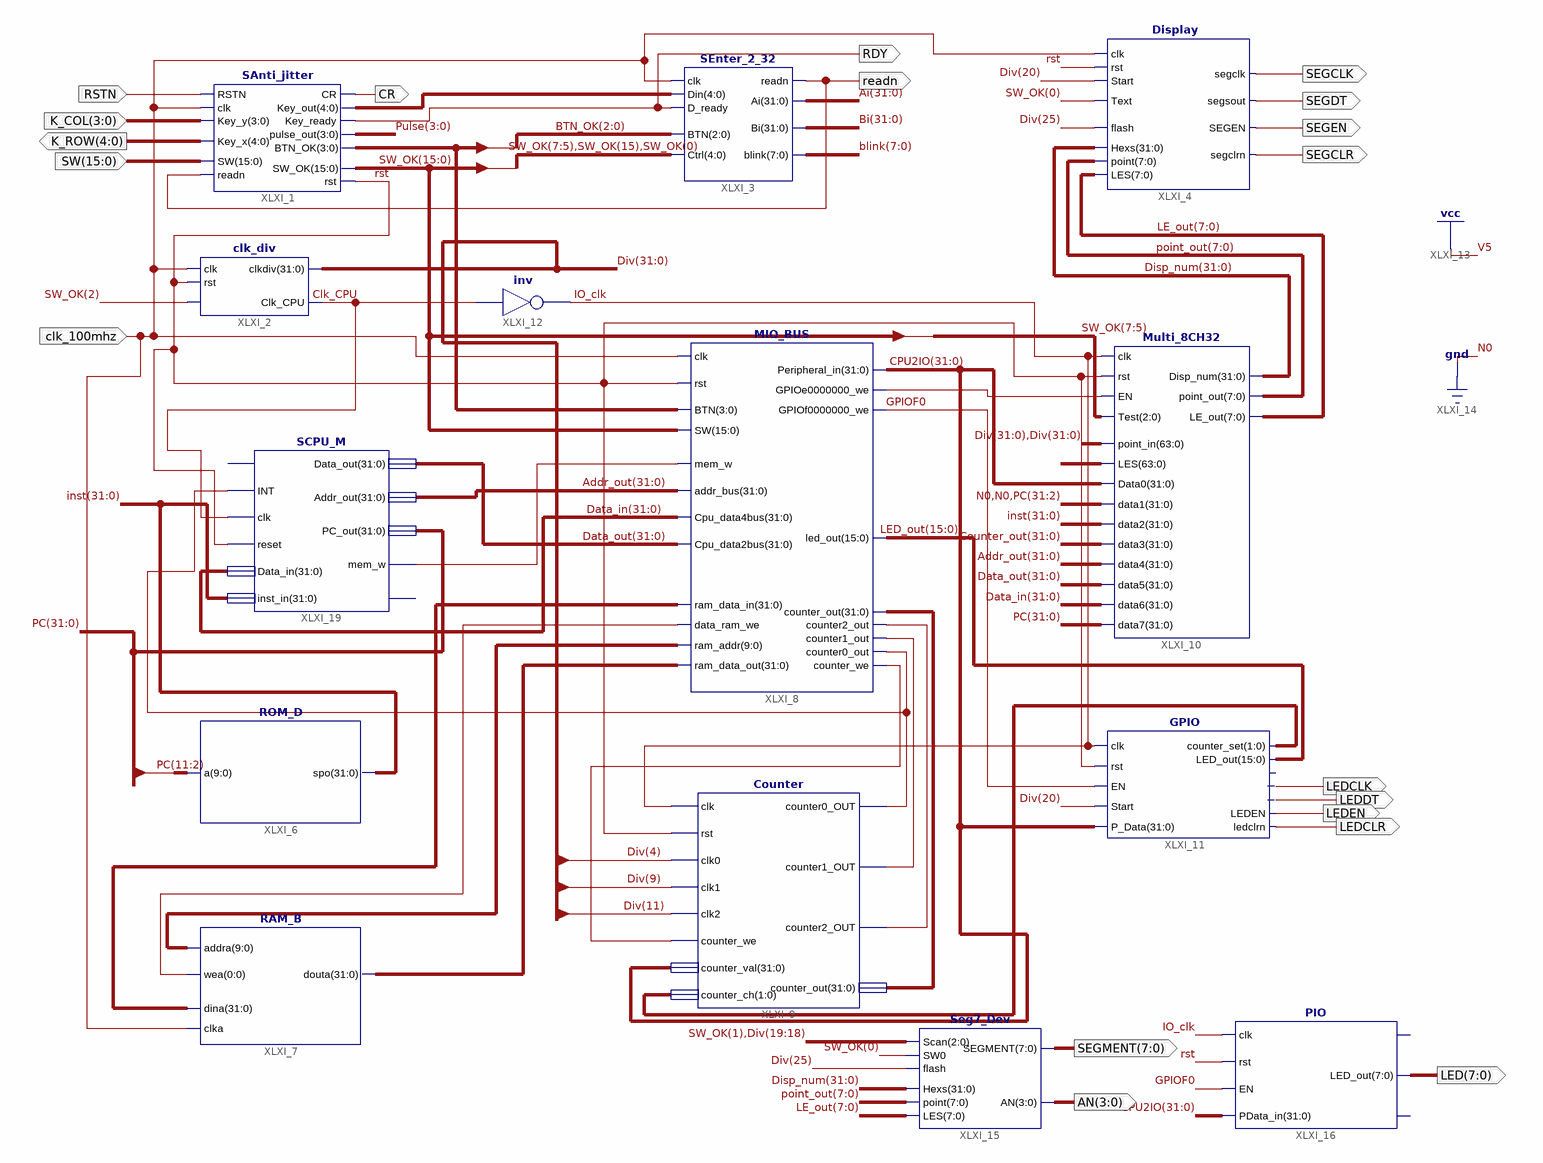
[diagram p0: schematic sheet 1]
// Xilinx ISE schematic OExp07_ExtSCPU_3180101226.sch (kintex7) as structural Verilog: 14 symbols, 19 ports
module OExp07_ExtSCPU_3180101226 (
  input  RSTN,
  input  [3:0] K_COL,
  input  [15:0] SW,
  input  clk_100mhz,
  output [4:0] K_ROW,
  output readn,
  output CR,
  output RDY,
  output SEGCLK,
  output SEGDT,
  output SEGEN,
  output SEGCLR,
  output LEDCLK,
  output LEDDT,
  output LEDEN,
  output LEDCLR,
  output [7:0] SEGMENT,
  output [3:0] AN,
  output [7:0] LED
);

  wire Clk_CPU, GPIOF0, IO_clk, rst, XLXN_73, XLXN_92, XLXN_93, XLXN_94, XLXN_96, XLXN_100;
  wire [0:0] XLXN_62;
  wire [1:0] XLXN_98;
  wire [3:0] BTN_OK, Pulse;
  wire [4:0] XLXN_9;
  wire [7:0] blink, LE_out, point_out;
  wire [9:0] XLXN_63;
  wire [15:0] LED_out, SW_OK;
  wire [31:0] Addr_out, Ai, Bi, Counter_out, CPU2IO, Data_in, Data_out, Disp_num, Div, inst, PC, XLXN_59,
       XLXN_65, XLXN_91;

  SAnti_jitter XLXI_1 (
    .SW(SW), .readn(readn), .Key_y(K_COL), .Key_x(K_ROW), .RSTN(RSTN), .clk(clk_100mhz), .Key_out(XLXN_9),
    .Key_ready(RDY), .CR(CR), .rst(rst), .SW_OK(SW_OK), .pulse_out(Pulse), .BTN_OK(BTN_OK));
  clk_div XLXI_2 (.rst(rst), .clk(clk_100mhz), .clkdiv(Div), .Clk_CPU(Clk_CPU));  // open: SW2
  SEnter_2_32 XLXI_3 (
    .readn(readn), .Ai(Ai), .Bi(Bi), .blink(blink), .Din(XLXN_9), .D_ready(RDY), .clk(clk_100mhz),
    .Ctrl({SW_OK[7:5], SW_OK[15], SW_OK[0]}), .BTN(BTN_OK[2:0]));
  Display XLXI_4 (
    .LES(LE_out), .SEGEN(SEGEN), .segsout(SEGDT), .segclrn(SEGCLR), .point(point_out), .Hexs(Disp_num),
    .Text(SW_OK[0]), .flash(Div[25]), .segclk(SEGCLK), .clk(clk_100mhz), .rst(rst), .Start(Div[20]));
  ROM_D XLXI_6 (.a(PC[11:2]), .spo(inst));
  RAM_B XLXI_7 (.addra(XLXN_63), .clka(clk_100mhz), .wea(XLXN_62[0]), .dina(XLXN_59), .douta(XLXN_65));
  MIO_BUS XLXI_8 (
    .rst(rst), .clk(clk_100mhz), .mem_w(XLXN_100), .addr_bus(Addr_out), .Cpu_data4bus(Data_in),
    .Cpu_data2bus(Data_out), .ram_data_out(XLXN_65), .ram_addr(XLXN_63), .data_ram_we(XLXN_62[0]),
    .ram_data_in(XLXN_59), .counter_out(XLXN_91), .counter2_out(XLXN_92), .counter1_out(XLXN_93),
    .counter0_out(XLXN_94), .counter_we(XLXN_96), .BTN(BTN_OK), .SW(SW_OK), .led_out(LED_out),
    .Peripheral_in(CPU2IO), .GPIOe0000000_we(XLXN_73), .GPIOf0000000_we(GPIOF0));
  Counter XLXI_9 (
    .clk(IO_clk), .rst(rst), .clk0(Div[4]), .clk1(Div[9]), .clk2(Div[11]), .counter_we(XLXN_96),
    .counter_val(CPU2IO), .counter_ch(XLXN_98), .counter0_OUT(XLXN_94), .counter1_OUT(XLXN_93),
    .counter2_OUT(XLXN_92), .counter_out(XLXN_91));
  Multi_8CH32 XLXI_10 (
    .Test(SW_OK[7:5]), .point_in({Div, Div}), .EN(XLXN_73), .clk(IO_clk), .rst(rst), .LES({64{1'b0}}),
    .Data0(CPU2IO), .data1({2'b00, PC[31:2]}), .data2(inst), .data3(Counter_out), .data4(Addr_out),
    .data5(Data_out), .data6(Data_in), .data7(PC), .point_out(point_out), .LE_out(LE_out), .Disp_num(Disp_num));
  GPIO XLXI_11 (
    .clk(IO_clk), .P_Data(CPU2IO), .rst(rst), .EN(GPIOF0), .Start(Div[20]), .ledclk(LEDCLK),
    .LED_out(LED_out), .counter_set(XLXN_98), .ledclrn(LEDCLR), .LEDEN(LEDEN), .ledsout(LEDDT));  // open: GPIOf0
  not XLXI_12 (IO_clk, Clk_CPU);
  Seg7_Dev XLXI_15 (
    .LES(LE_out), .Scan({SW_OK[1], Div[19:18]}), .SEGMENT(SEGMENT), .AN(AN), .point(point_out),
    .flash(Div[25]), .SW0(SW_OK[0]), .Hexs(Disp_num));
  PIO XLXI_16 (.clk(IO_clk), .rst(rst), .EN(GPIOF0), .PData_in(CPU2IO), .LED_out(LED));  // open: GPIOf0, counter_set
  SCPU_M XLXI_19 (
    .INT(XLXN_94), .clk(Clk_CPU), .reset(rst), .Data_in(Data_in), .inst_in(inst), .Data_out(Data_out),
    .Addr_out(Addr_out), .PC_out(PC), .mem_w(XLXN_100));  // open: MIO_ready, CPU_MIO
endmodule
